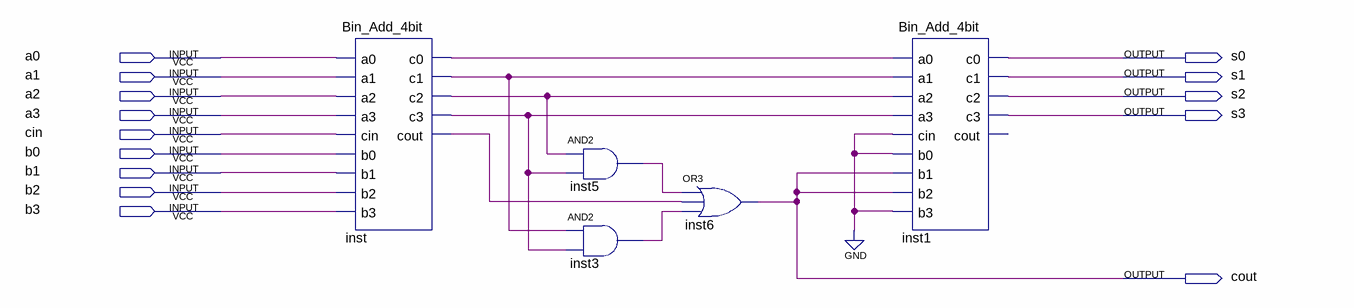
[diagram p0: schematic sheet]
// Quartus schematic BCD_Add.bdf as structural Verilog: 5 symbols, 14 pins
module BCD_Add (
  input  a0,
  input  a1,
  input  a2,
  input  a3,
  input  cin,
  input  b0,
  input  b1,
  input  b2,
  input  b3,
  output s0,
  output s1,
  output s2,
  output s3,
  output cout
);

  wire inst3_out, inst5_out, inst_c0, inst_c1, inst_c2, inst_c3, inst_cout;

  Bin_Add_4bit inst (
    .a0(a0), .a1(a1), .a2(a2), .a3(a3), .cin(cin), .b0(b0), .b1(b1), .b2(b2), .b3(b3), .c0(inst_c0),
    .c1(inst_c1), .c2(inst_c2), .c3(inst_c3), .cout(inst_cout));
  and inst5 (inst5_out, inst_c2, inst_c3);
  and inst3 (inst3_out, inst_c1, inst_c3);
  or inst6 (cout, inst5_out, inst_cout, inst3_out);
  Bin_Add_4bit inst1 (
    .a0(inst_c0), .a1(inst_c1), .a2(inst_c2), .a3(inst_c3), .cin(1'b0), .b0(1'b0), .b1(cout), .b2(cout),
    .b3(1'b0), .c0(s0), .c1(s1), .c2(s2), .c3(s3));  // open: cout
endmodule
